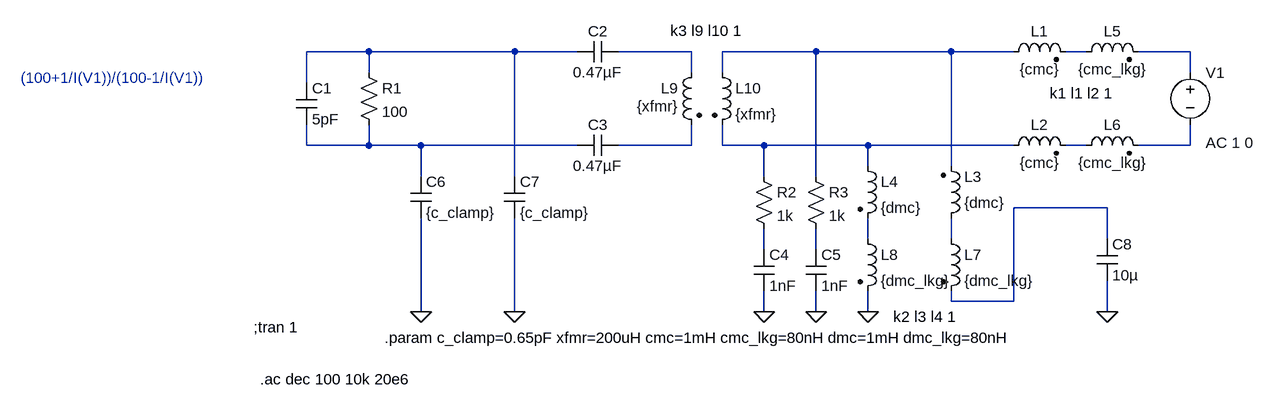
[diagram p0: schematic MDI Return Loss.asc]
MDI Return Loss.asc, the LTspice schematic file:
Version 4
SHEET 1 1316 680
WIRE -48 96 -144 96
WIRE 176 96 -48 96
WIRE 272 96 176 96
WIRE 448 96 336 96
WIRE 640 96 496 96
WIRE 848 96 640 96
WIRE 944 96 848 96
WIRE 1056 96 1024 96
WIRE 1216 96 1136 96
WIRE -48 128 -48 96
WIRE 448 128 448 96
WIRE 496 128 496 96
WIRE 1216 128 1216 96
WIRE -144 144 -144 96
WIRE -144 240 -144 208
WIRE -48 240 -48 208
WIRE -48 240 -144 240
WIRE 32 240 -48 240
WIRE 272 240 32 240
WIRE 448 240 448 208
WIRE 448 240 336 240
WIRE 496 240 496 208
WIRE 560 240 496 240
WIRE 720 240 560 240
WIRE 944 240 720 240
WIRE 1056 240 1024 240
WIRE 1216 240 1216 208
WIRE 1216 240 1136 240
WIRE 720 272 720 240
WIRE 848 272 848 96
WIRE 32 288 32 240
WIRE 176 288 176 96
WIRE 560 288 560 240
WIRE 640 288 640 96
WIRE 1088 336 944 336
WIRE 720 384 720 352
WIRE 848 384 848 352
WIRE 1088 384 1088 336
WIRE 560 400 560 368
WIRE 640 400 640 368
WIRE 848 480 848 464
WIRE 944 480 944 336
WIRE 944 480 848 480
WIRE 32 496 32 352
WIRE 176 496 176 352
WIRE 560 496 560 464
WIRE 640 496 640 464
WIRE 720 496 720 464
WIRE 1088 496 1088 448
FLAG 560 496 0
FLAG 640 496 0
FLAG 32 496 0
FLAG 176 496 0
FLAG 720 496 0
FLAG 1088 496 0
SYMBOL res -64 112 R0
SYMATTR InstName R1
SYMATTR Value 100
SYMBOL cap -160 144 R0
SYMATTR InstName C1
SYMATTR Value 5pF
SYMBOL cap 336 80 R90
WINDOW 0 0 32 VBottom 2
WINDOW 3 32 32 VTop 2
SYMATTR InstName C2
SYMATTR Value 0.47µF
SYMBOL cap 336 224 R90
WINDOW 0 0 32 VBottom 2
WINDOW 3 32 32 VTop 2
SYMATTR InstName C3
SYMATTR Value 0.47µF
SYMBOL res 544 272 R0
SYMATTR InstName R2
SYMATTR Value 1k
SYMBOL res 624 272 R0
SYMATTR InstName R3
SYMATTR Value 1k
SYMBOL cap 544 400 R0
SYMATTR InstName C4
SYMATTR Value 1nF
SYMBOL cap 624 400 R0
SYMATTR InstName C5
SYMATTR Value 1nF
SYMBOL cap 16 288 R0
SYMATTR InstName C6
SYMATTR Value {c_clamp}
SYMBOL cap 160 288 R0
SYMATTR InstName C7
SYMATTR Value {c_clamp}
SYMBOL ind2 928 112 R270
WINDOW 0 32 56 VTop 2
WINDOW 3 5 56 VBottom 2
SYMATTR InstName L1
SYMATTR Value {cmc}
SYMATTR Type ind
SYMBOL ind2 928 256 R270
WINDOW 0 32 56 VTop 2
WINDOW 3 5 56 VBottom 2
SYMATTR InstName L2
SYMATTR Value {cmc}
SYMATTR Type ind
SYMBOL voltage 1216 112 R0
WINDOW 123 24 124 Left 2
WINDOW 39 0 0 Left 0
SYMATTR InstName V1
SYMATTR Value ""
SYMATTR Value2 AC 1 0
SYMBOL ind2 1040 112 R270
WINDOW 0 32 56 VTop 2
WINDOW 3 5 56 VBottom 2
SYMATTR InstName L5
SYMATTR Value {cmc_lkg}
SYMATTR Type ind
SYMATTR SpiceLine Rser=0.3
SYMBOL ind2 1040 256 R270
WINDOW 0 32 56 VTop 2
WINDOW 3 5 56 VBottom 2
SYMATTR InstName L6
SYMATTR Value {cmc_lkg}
SYMATTR Type ind
SYMATTR SpiceLine Rser=0.3
SYMBOL ind2 832 368 M180
WINDOW 0 36 80 Left 2
WINDOW 3 36 40 Left 2
SYMATTR InstName L3
SYMATTR Value {dmc}
SYMATTR Type ind
SYMBOL ind2 704 256 R0
SYMATTR InstName L4
SYMATTR Value {dmc}
SYMATTR Type ind
SYMBOL ind2 832 368 R0
SYMATTR InstName L7
SYMATTR Value {dmc_lkg}
SYMATTR Type ind
SYMATTR SpiceLine Rser=0.3
SYMBOL ind2 704 368 R0
SYMATTR InstName L8
SYMATTR Value {dmc_lkg}
SYMATTR Type ind
SYMATTR SpiceLine Rser=0.3
SYMBOL cap 1072 384 R0
SYMATTR InstName C8
SYMATTR Value 10µ
SYMBOL ind2 464 112 M0
WINDOW 3 36 68 Left 2
SYMATTR InstName L9
SYMATTR Value {xfmr}
SYMATTR Type ind
SYMBOL ind2 480 112 R0
SYMATTR InstName L10
SYMATTR Value {xfmr}
SYMATTR Type ind
TEXT -24 536 Left 2 !.param c_clamp=0.65pF xfmr=200uH cmc=1mH cmc_lkg=80nH dmc=1mH dmc_lkg=80nH
TEXT -226 520 Left 2 !;tran 1
TEXT -216 600 Left 2 !.ac dec 100 10k 20e6
TEXT 1000 160 Left 2 !k1 l1 l2 1
TEXT 856 504 Right 2 !k2 l3 l4 1
TEXT 416 64 Left 2 !k3 l9 l10 1
TEXT -584 136 Left 2 ;(100+1/I(V1))/(100-1/I(V1))

The netlist it stands for:
* MDI Return Loss.asc
R1 N001 N006 100
C1 N001 N006 5pF
C2 N002 N001 0.47µF
C3 N007 N006 0.47µF
R2 N008 N014 1k
R3 N003 N015 1k
C4 N014 0 1nF
C5 N015 0 1nF
C6 N006 0 {c_clamp}
C7 N001 0 {c_clamp}
L1 N003 N004 {cmc}
L2 N008 N009 {cmc}
V1 N005 N010 AC 1 0
L5 N004 N005 {cmc_lkg} Rser=0.3
L6 N009 N010 {cmc_lkg} Rser=0.3
L3 N013 N003 {dmc}
L4 N008 N012 {dmc}
L7 N013 N011 {dmc_lkg} Rser=0.3
L8 N012 0 {dmc_lkg} Rser=0.3
C8 N011 0 10µ
L9 N002 N007 {xfmr}
L10 N003 N008 {xfmr}
.param c_clamp=0.65pF xfmr=200uH cmc=1mH cmc_lkg=80nH dmc=1mH dmc_lkg=80nH
;tran 1
.ac dec 100 10k 20e6
k1 l1 l2 1
k2 l3 l4 1
k3 l9 l10 1
* (100+1/I(V1))/(100-1/I(V1))
.backanno
.end